# Altium schematic sheet CM_USB.SchDoc
size Tabloid; SheetNumber: 14; SheetTotal: 14; Sheet_Name: CM_USB; Size: 11x17
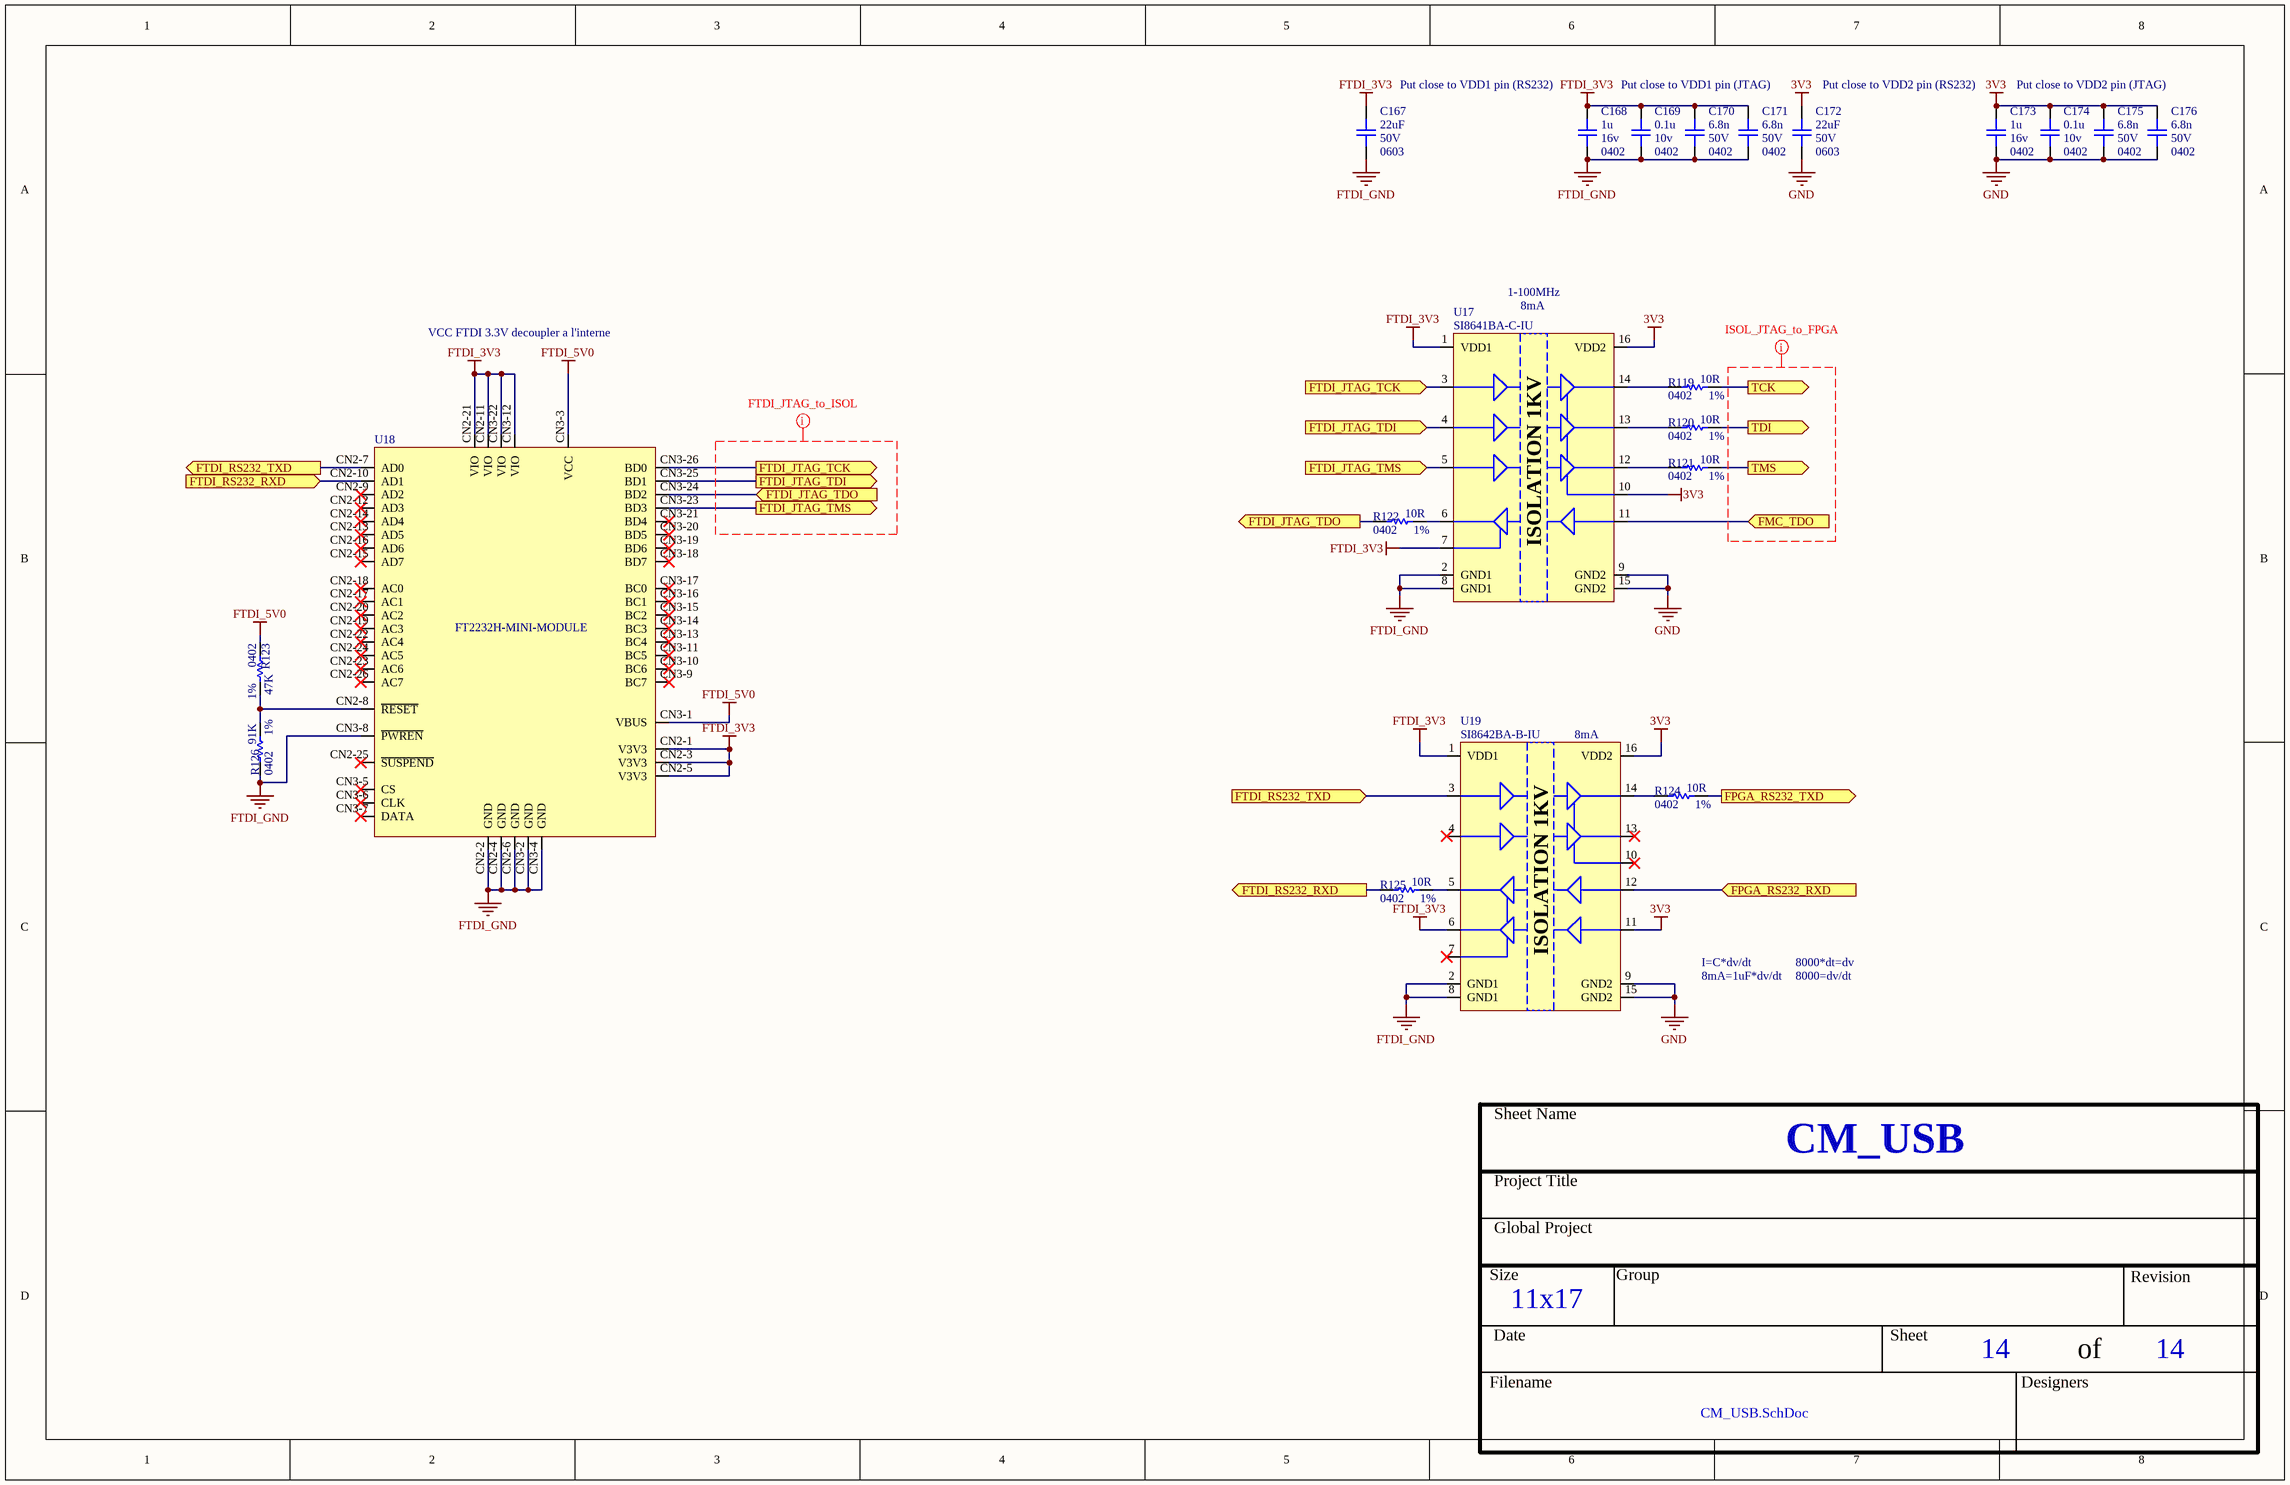
[diagram p0: CM_USB.SchDoc]

## Parts
C167  value 22uF  Voltage: 50V  Package: 0603  [CAP_0402]  (hidden comment: CAP - 0402)
C168  value 1u  Voltage: 16v  Package: 0402  [CAP_0402]  (hidden comment: CAP - 0402)
C169  value 0.1u  Voltage: 10v  Package: 0402  [CAP_0402]  (hidden comment: CAP - 0402)
C170  value 6.8n  Voltage: 50V  Package: 0402  [CAP_0402]  (hidden comment: CAP - 0402)
C171  value 6.8n  Voltage: 50V  Package: 0402  [CAP_0402]  (hidden comment: CAP - 0402)
C172  value 22uF  Voltage: 50V  Package: 0603  [CAP_0402]  (hidden comment: CAP - 0402)
C173  value 1u  Voltage: 16v  Package: 0402  [CAP_0402]  (hidden comment: CAP - 0402)
C174  value 0.1u  Voltage: 10v  Package: 0402  [CAP_0402]  (hidden comment: CAP - 0402)
C175  value 6.8n  Voltage: 50V  Package: 0402  [CAP_0402]  (hidden comment: CAP - 0402)
C176  value 6.8n  Voltage: 50V  Package: 0402  [CAP_0402]  (hidden comment: CAP - 0402)
R119  value 10R  Package: 0402  Precision: 1%  [RES_0402]  (hidden comment: RES - 0402)
R120  value 10R  Package: 0402  Precision: 1%  [RES_0402]  (hidden comment: RES - 0402)
R121  value 10R  Package: 0402  Precision: 1%  [RES_0402]  (hidden comment: RES - 0402)
R122  value 10R  Package: 0402  Precision: 1%  [RES_0402]  (hidden comment: RES - 0402)
R123  value 47K  Package: 0402  Precision: 1%  [RES_0402]  (hidden comment: RES - 0402)
R124  value 10R  Package: 0402  Precision: 1%  [RES_0402]  (hidden comment: RES - 0402)
R125  value 10R  Package: 0402  Precision: 1%  [RES_0402]  (hidden comment: RES - 0402)
R126  value 91K  Package: 0402  Precision: 1%  [RES_0402]  (hidden comment: RES - 0402)
U17  SI8641BA-C-IU  [ISO_SI8642BA-B-IU]
U18  FT2232H-MINI-MODULE  [COM_USB_FT2232H-MINI-MODULE]
U19  SI8642BA-B-IU  [ISO_SI8642BA-B-IU]

## Ports
FMC_TDO (in), FPGA_RS232_RXD (in), FPGA_RS232_TXD (out), FTDI_JTAG_TCK (in), FTDI_JTAG_TCK (out), FTDI_JTAG_TDI (in), FTDI_JTAG_TDI (out), FTDI_JTAG_TDO (in), FTDI_JTAG_TDO (out), FTDI_JTAG_TMS (in), FTDI_JTAG_TMS (out), FTDI_RS232_RXD (in), FTDI_RS232_RXD (out), FTDI_RS232_TXD (in), FTDI_RS232_TXD (out), TCK (out), TDI (out), TMS (out)

## Nets
3V3: C172.2 C173.2 C174.2 C175.2 C176.2 U17.10(EN2) U17.16(VDD2) U19.11(B4) U19.16(VDD2)
FTDI_3V3: C167.2 C168.2 C169.2 C170.2 C171.2 U17.1(VDD1) U17.7(EN1) U18.CN2-1(V3V3) U18.CN2-3(V3V3) U18.CN2-5(V3V3) U18.CN2-11(VIO) U18.CN2-21(VIO) U18.CN3-12(VIO) U18.CN3-22(VIO) U19.1(VDD1) U19.6(A4)
FTDI_5V0: R123.1 U18.CN3-1(VBUS) U18.CN3-3(VCC)
FTDI_GND: C167.1 C168.1 C169.1 C170.1 C171.1 R126.1 U17.2(GND1) U17.8(GND1) U18.CN2-2(GND) U18.CN2-4(GND) U18.CN2-6(GND) U18.CN3-2(GND) U18.CN3-4(GND) U18.CN3-8(~{PWREN}) U19.2(GND1) U19.8(GND1)
GND: C172.1 C173.1 C174.1 C175.1 C176.1 U17.9(GND2) U17.15(GND2) U19.9(GND2) U19.15(GND2)
FMC_TDO: U17.11(B4) ; port FMC_TDO
FPGA_RS232_RXD: U19.12(B3) ; port FPGA_RS232_RXD
FPGA_RS232_TXD: R124.2 ; port FPGA_RS232_TXD
FTDI_JTAG_TCK: U17.3(A1) U18.CN3-26(BD0) ; port FTDI_JTAG_TCK
FTDI_JTAG_TDI: U17.4(A2) U18.CN3-25(BD1) ; port FTDI_JTAG_TDI
FTDI_JTAG_TDO: R122.1 U18.CN3-24(BD2) ; port FTDI_JTAG_TDO
FTDI_JTAG_TMS: U17.5(A3) U18.CN3-23(BD3) ; port FTDI_JTAG_TMS
FTDI_RS232_RXD: R125.1 U18.CN2-10(AD1) ; port FTDI_RS232_RXD
FTDI_RS232_TXD: U18.CN2-7(AD0) U19.3(A1) ; port FTDI_RS232_TXD
TCK: R119.2 ; port TCK
TDI: R121.2 ; port TDI
TMS: R120.2 ; port TMS
NetR119_1: R119.1 U17.14(B1)
NetR120_1: R120.1 U17.12(B3)
NetR121_1: R121.1 U17.13(B2)
NetR122_2: R122.2 U17.6(A4)
NetR123_2: R123.2 R126.2 U18.CN2-8(~{RESET})
NetR124_1: R124.1 U19.14(B1)
NetR125_2: R125.2 U19.5(A3)

Not connected (* = marked no-connect by the designer): U18 CN2-9(AD2)* CN2-12(AD3)* CN2-13(AD5)* CN2-14(AD4)* CN2-15(AD7)* CN2-16(AD6)* CN2-17(AC1)* CN2-18(AC0)* CN2-19(AC3)* CN2-20(AC2)* CN2-22(AC4)* CN2-23(AC6)* CN2-24(AC5)* CN2-25(~{SUSPEND})* CN2-26(AC7)* CN3-5(CS)* CN3-6(CLK)* CN3-7(DATA)* CN3-9(BC7)* CN3-10(BC6)* CN3-11(BC5)* CN3-13(BC4)* CN3-14(BC3)* CN3-15(BC2)* CN3-16(BC1)* CN3-17(BC0)* CN3-18(BD7)* CN3-19(BD6)* CN3-20(BD5)* CN3-21(BD4)*; U19 4(A2)* 7(EN1)* 10(EN2)* 13(B2)*

## Layout directives
net class FTDI_JTAG_to_ISOL: (no net found under the mark)
net class ISOL_JTAG_to_FPGA: (no net found under the mark)

## Notes on the sheet
- Put close to VDD1 pin (RS232)
- Put close to VDD1 pin (JTAG)
- Put close to VDD2 pin (RS232)
- Put close to VDD2 pin (JTAG)
- (near U17) 1-100MHz
- VCC FTDI 3.3V decoupler a l'interne
- (near U17) 8mA
- (near U19) 8mA
- I=C*dv/dt
- 8000*dt=dv
- 8mA=1uF*dv/dt
- 8000=dv/dt
- Sheet Name
- Project Title
- Global Project
- Size
- Group
- Revision
- Date
- Sheet
- of
- Filename
- Designers
- (in symbol ISO_SI8641BA-C-IU) ISOLATION 1KV
- (in symbol ISO_SI8642BA-B-IU) ISOLATION 1KV

## Library data of the parts
C167-C176 = CAP - 0402: Precision: 10%; Current: *; CreatedBy: Jonathan Bouchard; Power: *
R119-R126 = RES - 0402: Voltage: 50V; Power: 1/16W; Current: *; CreatedBy: Jonathan Bouchard
U17 = ISO_SI8641BA-C-IU: ISO - DIGITAL ISOLATOR 1KV 4CH 3:1 GEN PURP -  SOP-16; Voltage: 2.5 V ~ 5.5 V; Mfg: Silicon Labs; Current: *; Power: *; Mfg Part Number: SI8641BA-C-IU; HelpURL: http://www.silabs.com/Support%20Documents/TechnicalDocs/si864x-datasheet.pdf; CreatedBy: Jonathan Bouchard; Temperature: -40°C ~ 125°C; Value: *; Precision: *; Package: SOP-16; Supplier 1: Digikey; Supplier Part Number 1: SI8641BA-C-IU-ND
U18 = COM_USB_FT2232H-MINI-MODULE: COM - USB FTDI FT2232H Mini-Module - TH; Mfg: Micrel; Voltage: *; Current: *; Power: *; Mfg Part Number: FT2232H-MINI-MODULE; HelpURL: http://www.ftdichip.com/Support/Documents/DataSheets/Modules/DS_FT2232H_Mini_Module.pdf; CreatedBy: Jonathan Bouchard; Temperature: *; Value: *; Precision: *; Package: TH; Supplier 1: Digikey; Supplier Part Number 1: 768-1030-ND
U19 = ISO_SI8642BA-B-IU: ISO - DIGITAL ISOLATOR 1KV 4CH 2:2 GEN PURP -  SOP-16; Voltage: 2.5 V ~ 5.5 V; Mfg: Silicon Labs; Current: *; Power: *; Mfg Part Number: SI8642BA-B-IU; HelpURL: http://www.silabs.com/Support%20Documents/TechnicalDocs/si864x-datasheet.pdf; CreatedBy: Jonathan Bouchard; Temperature: -40°C ~ 125°C; Value: *; Precision: *; Package: SOP-16; Supplier 1: Digikey; Supplier Part Number 1: 336-2091-5-ND